# Altium schematic sheet Esquemático.SchDoc
size A4; SheetNumber: 1; SheetTotal: 1
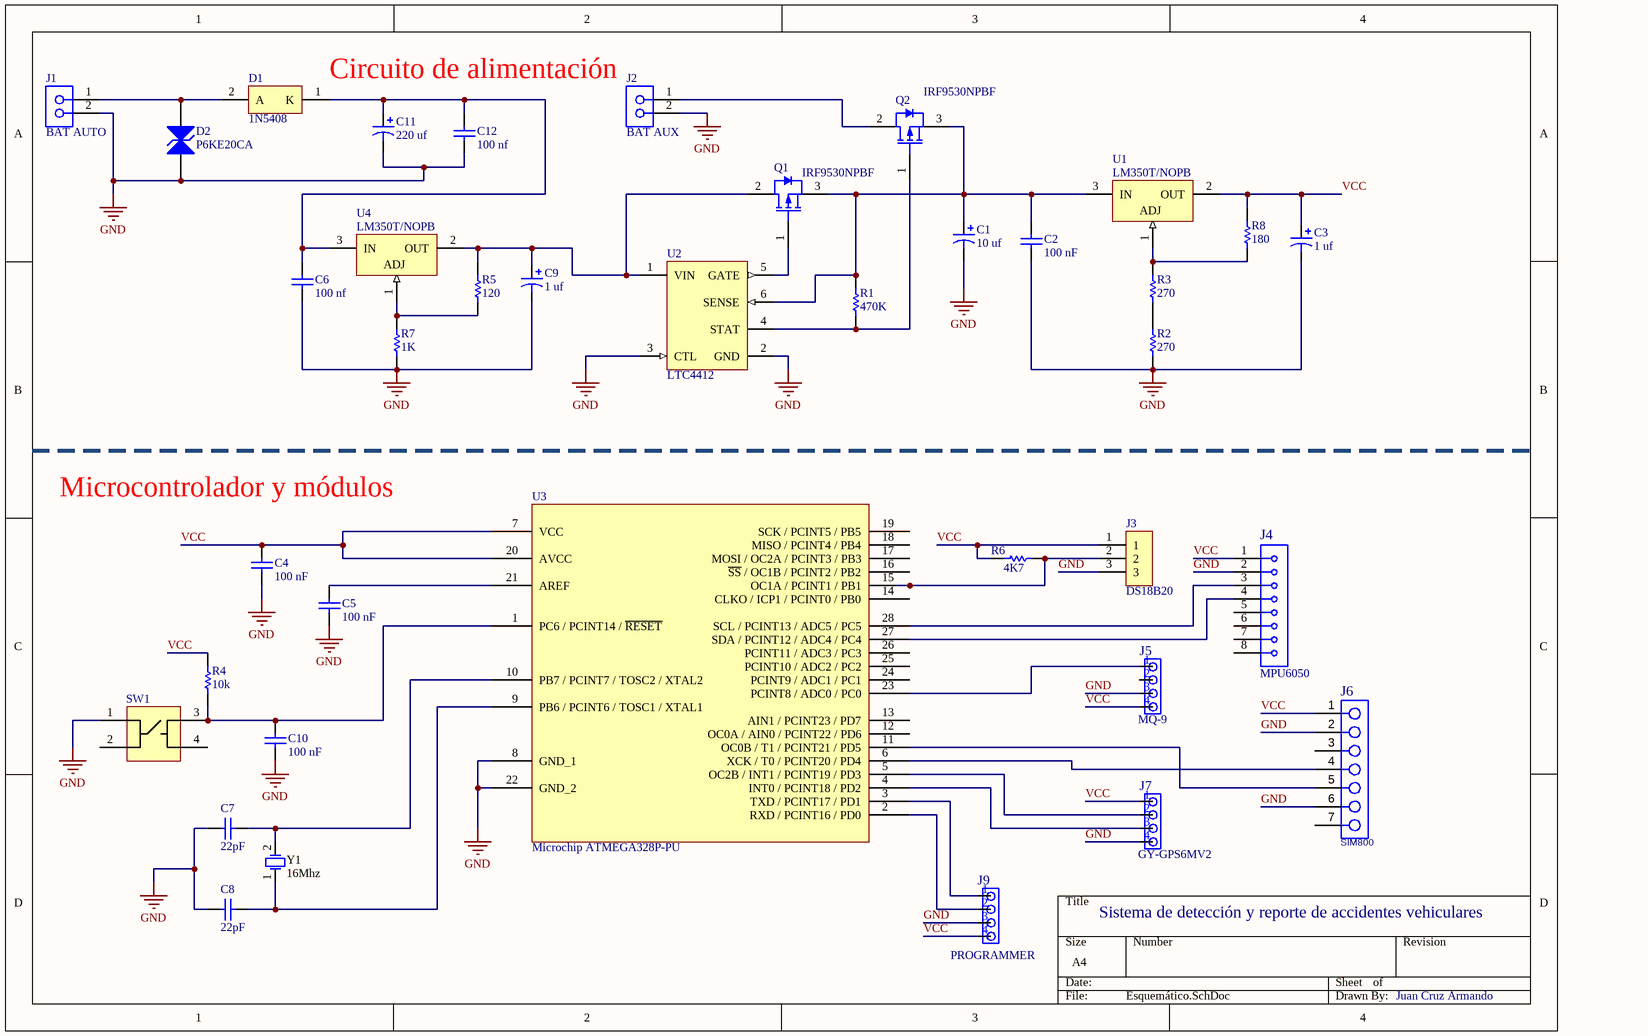
[diagram p0: Esquemático.SchDoc]

## Parts
C1  10 uf  [PCB-imxzc0h3ulzopa7zwnih-1]
C2  100 nF  [PCB-ql28fbuo3tond8refhb5-1]
C3  1 uf  [PCB-acyh3aj9bk846069dhs3-1]
C4  100 nF  [PCB-cdnsso2r2iuvlncjnkpk-1]
C5  100 nF  [PCB-cdnsso2r2iuvlncjnkpk-1]
C6  100 nf  [PCB-ql28fbuo3tond8refhb5-1]
C7  22pF  [PCB-tqy8x0fx5p36cua9t83l-1]
C8  22pF  [PCB-tqy8x0fx5p36cua9t83l-1]
C9  1 uf  [PCB-acyh3aj9bk846069dhs3-1]
C10  100 nF  [PCB-cdnsso2r2iuvlncjnkpk-1]
C11  220 uf  [PCB-imxzc0h3ulzopa7zwnih-1]
C12  100 nf  [PCB-ql28fbuo3tond8refhb5-1]
D1  1N5408  [ONSC-AXIAL_LEAD-2-267-05_V]
D2  P6KE20CA  [PCB-4dyrkuvni5xning65e4c-1]
J1  BAT AUTO  [PCB-kiok1jlp9o9fcwf1wwvf-1]
J2  BAT AUX  [PCB-kiok1jlp9o9fcwf1wwvf-1]
J3  DS18B20  [PCB-t3j82fujp56a0y7cbkwq-1]
J4  MPU6050  [PCB-zdm29xznpx2fif9lk3na-1]
J5  MQ-9  [PCB-0bfjvpkufifbx95u45yw-1]
J6  SIM800  [PCBComponent_1]
J7  GY-GPS6MV2  [PCB-0bfjvpkufifbx95u45yw-1]
J9  PROGRAMMER  [PCB-0bfjvpkufifbx95u45yw-1]
Q1  IRF9530NPBF  [Infineon IRF9530NPBF-Footprint-1]
Q2  IRF9530NPBF  [Infineon IRF9530NPBF-Footprint-1]
R1  470K  [Yageo CFR-25JT-52-470K-Footprint-1]
R2  270  [PCB-akkdcmgfauh1vh9d0cz2-1]
R3  270  [PCB-akkdcmgfauh1vh9d0cz2-1]
R4  10k  [PCB-srwdokf50franrk04i3o-1]
R5  120  [PCB-akkdcmgfauh1vh9d0cz2-1]
R6  4K7  [PCB-jdq3crg2pt2ynotio4yr-1]
R7  1K  [Yageo CFR-25JT-52-470K-Footprint-1]
R8  180  [PCB-akkdcmgfauh1vh9d0cz2-1]
SW1  E-Switch TL1105BF250Q  [PCB-w1cc0e0zrtxe6z7oi7lq-1]  (value not drawn)
U1  LM350T/NOPB  [T03B]
U2  LTC4412  [LT-S6-6-TSOT-23_L]
U3  Microchip ATMEGA328P-PU  [PCB-n0zq5lox7fck5k780cz8-1]
U4  LM350T/NOPB  [T03B]
Y1  16Mhz  [FOX-FOXSLF160-20]

## Nets
GND: C1.2 C2.1 C3.2 C4.1 C5.1 C6.1 C7.1 C8.1 C9.2 C10.1 C11.2 C12.1 D2.1(A) J1.2 J2.2 J3.3 J4.2 J5.3 J6.2 J6.6 J7.4 J9.3 R2.1 R7.1 SW1.1 U2.2(GND) U2.3(CTL) U3.8(GND_1) U3.22(GND_2)
VCC: C3.1 C4.2 J3.1 J4.1 J5.4 J6.1 J7.1 J9.4 R4.2 R6.1 R8.2 U1.2(OUT) U3.7(VCC) U3.20(AVCC)
NetC1_1: C1.1 C2.2 Q1.3(S) Q2.3(S) R1.2 U1.3(IN) U2.6(SENSE)
NetC5_2: C5.2 U3.21(AREF)
NetC6_2: C6.2 C11.1 C12.2 D1.1(K) U4.3(IN)
NetC7_2: C7.2 U3.10(PB7_/_PCINT7_/_TOSC2_/_XTAL2) Y1.2
NetC8_2: C8.2 U3.9(PB6_/_PCINT6_/_TOSC1_/_XTAL1) Y1.1
NetC9_1: C9.1 Q1.2(D) R5.2 U2.1(VIN) U4.2(OUT)
NetC10_2: C10.2 R4.1 SW1.3 U3.1(PC6_/_PCINT14_/_~{RESET})
NetD1_2: D1.2(A) D2.2(K) J1.1
NetJ2_1: J2.1 Q2.2(D)
NetJ3_2: J3.2 R6.2 U3.15(OC1A_/_PCINT1_/_PB1)
NetJ4_3: J4.3 U3.28(SCL_/_PCINT13_/_ADC5_/_PC5)
NetJ4_4: J4.4 U3.27(SDA_/_PCINT12_/_ADC4_/_PC4)
NetJ5_1: J5.1 U3.23(PCINT8_/_ADC0_/_PC0)
NetJ6_4: J6.4 U3.6(XCK_/_T0_/_PCINT20_/_PD4)
NetJ6_5: J6.5 U3.11(OC0B_/_T1_/_PCINT21_/_PD5)
NetJ7_2: J7.2 U3.5(OC2B_/_INT1_/_PCINT19_/_PD3)
NetJ7_3: J7.3 U3.4(INT0_/_PCINT18_/_PD2)
NetJ9_1: J9.1 U3.3(TXD_/_PCINT17_/_PD1)
NetJ9_2: J9.2 U3.2(RXD_/_PCINT16_/_PD0)
NetQ1_1: Q1.1(G) U2.5(GATE)
NetQ2_1: Q2.1(G) R1.1 U2.4(STAT)
NetR2_2: R2.2 R3.1
NetR3_2: R3.2 R8.1 U1.1(ADJ)
NetR5_1: R5.1 R7.2 U4.1(ADJ)

Not connected (* = marked no-connect by the designer): J4 5 6 7 8; J5 2; J6 3 7; SW1 2 4; U3 12(OC0A_/_AIN0_/_PCINT22_/_PD6) 13(AIN1_/_PCINT23_/_PD7) 14(CLKO_/_ICP1_/_PCINT0_/_PB0) 16(~{SS}_/_OC1B_/_PCINT2_/_PB2) 17(MOSI_/_OC2A_/_PCINT3_/_PB3) 18(MISO_/_PCINT4_/_PB4) 19(SCK_/_PCINT5_/_PB5) 24(PCINT9_/_ADC1_/_PC1) 25(PCINT10_/_ADC2_/_PC2) 26(PCINT11_/_ADC3_/_PC3)

## Notes on the sheet
- (near J2) Circuito de alimentación
- Microcontrolador y módulos
- Sistema de detección y reporte de accidentes vehiculares
- Juan Cruz Armando

## Library data of the parts
C1 C11 = CMP-6a29a3234e15b5ee-2: Capacitor Tantalum Solid 10uF 25V 10% (5.5 X 9mm) Radial 2.5mm 2.5 Ohm 125C Bulk; Manufacturer Part Number: TAP106K025SCS; Manufacturer: AVX; Lead-Free Status: Lead Free; Capacitance: 10.0 µF; Equivalent Series Resistance (ESR): 2.50 Ω; Voltage Rating (DC): 25.0 V; Size-Diameter: 5.59 mm; Number of Pins: 2; OctopartID: 6a29a3234e15b5ee; Capacitance Tolerance: ±10%; Size-Height: 8.89 mm; REACH SVHC Compliance: No SVHC; Mounting Style: Through Hole; RoHS: Compliant; Octopart URL: http://octopart.com/tap106k025scs-avx-346; Packaging: Bag
C2 C6 C12 = CMP-1272d9258f2acdb5-7: K 100nF Ceramic Multilayer Capacitor, 50 V dc, +125degC, X7R Dielectric, +/-10%
C3 C9 = CMP-ee3b2732de2731fc-6: VR Series 1 uF 50 V 85°C Ø5 x 11 mm LS=2mm Radial Aluminum Electrolytic Cap
C4 C5 C10 = CMP-ce6b025bcb0911ac-1: 100nF ceramic capacitor; Manufacturer Part Number: K104K10X7RF5UH5; OctopartID: ce6b025bcb0911ac; Octopart Url: https://octopart.com/k104k10x7rf5uh5-vishay+specialty+capacitors-87695364
C7 C8 = CMP-0071cbfa31a6dfb6-7: Cap Ceramic 22pF 50V C0G 5% Radial 2.5mm 125°C Bulk
D1 = CMP-4964573-2: Standard Recovery Rectifier, 2-Pin Axial_Lead, Pb-Free, Tape and Reel; Manufacturer Part Number: 1N5408RLG; Current Rating: 3.0 A; Lead-Free Status: Lead Free; Voltage Rating (DC): 1000.0 V; Halogen Free Status: Halogen Free; Lifecycle Status: Active; Mounting Style: Axial; Number of Pins: 2; Octopart Url: https://octopart.com/1n5408rlg-on+semiconductor-323163; OctopartID: d16e18601a530ea9; Packaging: Cut Tape (CT); Polarity: Standard; REACH SVHC Compliance: No SVHC; RoHS: Compliant
D2 = CMP-eff326f9b9a13034-1: In a Pack of 5, ON Semiconductor P6KE20CA, Bi-Directional TVS Diode, 600W, 2-Pin DO-15; Power Dissipation: 600 W (min); Voltage Rating (DC): 20.0 V; Breakdown Voltage: 21.0 V (max); Lead-Free Status: Lead Free; Lifecycle Status: Active; OctopartID: eff326f9b9a13034; REACH SVHC Compliance: No SVHC; Mounting Style: Through Hole; Case/Package: DO-15; Size-Length: 7.60 mm; RoHS: Compliant; Octopart URL: https://octopart.com/p6ke20ca-littelfuse-29492; Manufacturer Part Number: P6KE20CA; Packaging: Cut Tape (CT), Tape & Reel (TR); Operating Temperature: 175 °C (max); Size-Diameter: 3.60 mm; Number of Pins: 2; Power Rating: 600 W
J1 J2 = CMP-7ad9b3d37ed8a51e-5: Block, Terminal; 13.5 A; 250 V; 5 mm; 26 to 16 AWG; 2; Screw; Solder; 4 kV; PA
J3 = CMP-56249debc17089e3-37: AMPMODU 3 Position Through-Hole Single Row 0.1 Inch Straight Breakaway Header; Manufacturer Part Number: 5-146281-3; Number of Contacts: 3; Lead-Free Status: Lead Free; ELV Compliant: Compliant; Gender: Male; Octopart URL: http://octopart.com/5-146281-3-te+connectivity-46510642; Housing Color: Black; Contact Material: Copper Alloy; Orientation: Vertical; Mounting Style: PCB; Lifecycle Status: Active; RoHS: Compliant; OctopartID: 56249debc17089e3; Flammability Rating: UL 94 V-0; Contact Plating: Tin, Tin over Nickel, Gold
J4 = CMP-1d33d663ca37c2f4-5: Conn Unshrouded Header HDR 8 POS 2.54mm Solder ST Top Entry Thru-Hole Bag/Box; ComponentLink1Description: Octopart Url; ComponentLink1URL: https://octopart.com/search?q=3-644456-8; Footprint: PCB-zdm29xznpx2fif9lk3na-2
J5 J7 J9 = CMP-ce480524f220118f-1: 5-146274-4 ; ROHS ; TYCO ; AMPMODU Breakaway Heade rs 4P HEADER TIN single r ow; ELV Compliant: Compliant; RoHS: Compliant; Contact Material: Phosphor Bronze; Housing Color: Black; Flammability Rating: UL 94 V-0; Mounting Style: PCB; Orientation: Vertical; Lifecycle Status: Active; Manufacturer Part Number: 5-146274-4; Contact Plating: Tin, Tin over Nickel; OctopartID: ce480524f220118f; Octopart URL: http://octopart.com/5-146274-4-te+connectivity+%2F+amp-40245518
J6 = CMP-ee5625308a0b3191-4: Conn Unshrouded Header HDR 7 POS 2.54mm Solder ST Thru-Hole; Manufacturer Part Number: 5-146280-7; Gender: Male; OctopartID: ee5625308a0b3191; Lifecycle Status: Not Listed by Manufacturer; RoHS: Compliant; Mounting Style: Through Hole, Solder; Octopart Url: https://octopart.com/5-146280-7-te+connectivity+%2F+amp-40649019
Q1 Q2 = CMP-50839a64528c8f44-5: Mosfet, Power; P-ch; Vdss -100V; Rds(on) 0.2 Ohm; Id -14A; TO-220AB; Pd 79W; Vgs +/-20V; Lead-Free Status: Lead Free; Rise Time: 58.0 ns; Drain to Source Resistance (on) (Rds): 200 mΩ; Power Dissipation: 79.0 W; Polarity: P-Channel; Current Rating: -14.0 A; Breakdown Voltage [Gate to Source]: -20.0 V to 20.0 V; RoHS: Compliant; Lifecycle Status: Active; Voltage Rating (DC): -100 V; Footprint: PCB-weaed7uh2b8ee87wfo2s-1; Manufacturer Part Number: IRF9530NPBF; REACH SVHC Compliance: No SVHC; Octopart URL: https://octopart.com/irf9530npbf-infineon-65873769; Breakdown Voltage (Drain to Source): -100 V; Drain to Source Voltage (Vds): -100 V; Mounting Style: Through Hole; Operating Temperature: -55.0 °C to 175 °C; Part Family: IRF9530N; Number of Pins: 3; OctopartID: 50839a64528c8f44; Continuous Drain Current (Ids): -14.0 A; Packaging: Bulk
R1 R7 = CMP-1a14d22f523ac5d3-1: Res Carbon Film 470K Ohm 5% 0.25W(1/4W) -700ppm/C to 0ppm/C Conformal Coated AXL Tape and Box; Manufacturer Part Number: CFR-25JT-52-470K; Lead-Free Status: Lead Free; Packaging: Ammo Pack; RoHS: Compliant; OctopartID: 1a14d22f523ac5d3; Octopart Url: https://octopart.com/cfr-25jt-52-470k-yageo-20016456; Mounting Style: Axial
R2 R3 R5 R8 = CMP-2e58e67d59dbf19f-2: General Purpose Mini Metal Film Leaded Resistor; Manufacturer Part Number: RNMF14FTC120R; 1/4 W: 250 mW; 120: 120 Ω; Axial: Tape & Reel (TR); 1%: ±1%; Mounting Style: Axial; OctopartID: 2e58e67d59dbf19f; Octopart URL: http://octopart.com/rnmf14ftc120r-stackpole+electronics-19878629; RNMF14FTC120R: RNMF14FTC120R; RoHS: Compliant
R4 = CMP-7662bf3a2cc5a9a5-10: R Series Axial Through Hole Fixed Resistor 10kOhms +/-0.1% 0.25W +/-15ppm/degC; Manufacturer Part Number: YR1B10KCC; Resistance: 10.0 kΩ; Lead Length: 25.0 mm; Temperature Coefficient: -15.0 ppm/°C to 15.0 ppm/°C; ELV Compliant: Compliant; Resistance Tolerance: ±0.1%; Power Rating: 250 mW; Voltage Rating (DC): 250 V, 500 V; Lifecycle Status: Active; OctopartID: 7662bf3a2cc5a9a5; Octopart URL: https://octopart.com/yr1b10kcc-te+connectivity-5406657; Mounting Style: Axial; Number of Pins: 2; Packaging: Ammo Pack; Operating Temperature: -65.0 °C to 155 °C; REACH SVHC Compliance: No SVHC; RoHS: Compliant
R6 = CMP-d9fa11ede6f3063d-1: Res Carbon Film 4.7K Ohm 5% 1/4W -500ppm/°C to 350ppm/°C Conformal AXL Thru-Hole Paper T/R; Manufacturer Part Number: CFR-25JR-52-4K7; Lead-Free Status: Lead Free; Octopart URL: https://octopart.com/cfr-25jr-52-4k7-yageo-18684527; OctopartID: d9fa11ede6f3063d; RoHS: Compliant; Packaging: Tape & Reel (TR)
SW1 = CMP-18efd1f51fafc728-1: Switch Tactile N.O. SPST Round Button PC Pins 0.05A 50VDC 2.45N Thru-Hole; Contacts Type: SPST-NO; Lead-Free Status: Lead Free; Actuator Type: Standard; Contact Current Rating: 50.0 mA; Manufacturer Part Number: TL1105BF250Q; Packaging: Bulk; Octopart URL: https://octopart.com/tl1105bf250q-e-switch-1057318; OctopartID: 18efd1f51fafc728; Orientation: Vertical; Size-Length: 6.00 mm; Contact Plating: Silver; Mounting Style: Through Hole, Vertical; RoHS: Compliant; Size-Width: 6.00 mm
U1 U4 = CMP-0062-02500-4: LDO; Current Rating: 3.0 A; Comment2: 1.2В…33В, 3А, TO220; Lead-Free Status: Lead Free; Dropout Voltage: 2.3 V; Number of Regulated Outputs: 1; Packaging: Tube; URL: http://www.chipdip.ru/product/lm350t/; Mounting Style: Through Hole; Manufacturer Part Number: LM350T/NOPB; RoHS: Compliant; Lifecycle Status: Active; OctopartID: cb9403e44f681453; Number of Pins: 3; Output Current: 3.0 A; Case/Package: TO-220; Octopart Url: https://octopart.com/lm350t%2Fnopb-texas+instruments-24813978
U2 = CMP-1435228-2: Low Loss PowerPath(TM) Controller, 2.5 to 36 V Vin, 6-pin SOT23 (S6-6), -40 to 125 degC, Pb-Free, Tape and Reel; Manufacturer Part Number: LTC4412HVIS6#TRPBF; Octopart Url: https://octopart.com/ltc4412hvis6%23trpbf-linear+technology-9435320; OctopartID: ef5f26da32813098; RoHS: Compliant
U3 = CMP-973188-64: ATMEGA328P-PU; 8 bit Microcontroller AVR 20MHz 1; 32kb Flash; 2kb RAM; I2C SPI 2; Manufacturer: Atmel; Parameter 1: 1; Lead-Free Status: Lead Free; RAM Memory Size: 2048 B; Clock Speed: 20.0 MHz; Supply Voltage (DC): 1.80 V (min); Manufacturer Part Number: ATMEGA328P-PU; RoHS: Compliant; Lifecycle Status: Not Listed by Manufacturer; REACH SVHC Compliance: No SVHC; Mounting Style: Through Hole; OctopartID: 60cead66c348bf09; Case/Package: SPDIP; Operating Temperature: -40.0 °C (min); Octopart URL: https://octopart.com/atmega328p-pu-microchip-77760224; Number of Pins: 28
Y1 = CMP-779993-11: Resistance Weld Thru-Hole Crystal, 16 MHz, -20 to 70 degC, 2-Pin THD, RoHS, Bulk; Manufacturer Part Number: FOXSLF/160-20; Lead-Free Status: Lead Free; Frequency: 16.0 MHz; Load Capacitance: 20.0 pF; OctopartID: 95dd5cd59e344a1a; Number of Pins: 2; RoHS: Compliant; Octopart Url: http://octopart.com/foxslf%2F160-20-fox+electronics-142991; Seller Landing  Url: https://octopart-clicks.com/click/track?country=US&ak=8157f166&sig=06808a0&sid=459&ppid=142991&vpid=1597788&ct=offers; Size-Height: 3.60 mm; PackageReference: FOXSLF160-20; DatasheetVersion: Mar-15; Case/Package: HC-49; Mounting Style: Through Hole; Packaging: Bulk; Size-Width: 4.65 mm; Size-Length: 11.4 mm; REACH SVHC Compliance: No SVHC; PackageDescription: 2-Pin Through Hole Device, Body 11.35 x 4.65 mm